# Altium schematic sheet IBVG-DRIVER.SchDoc
size Tabloid; SheetNumber: 5; SheetTotal: 10
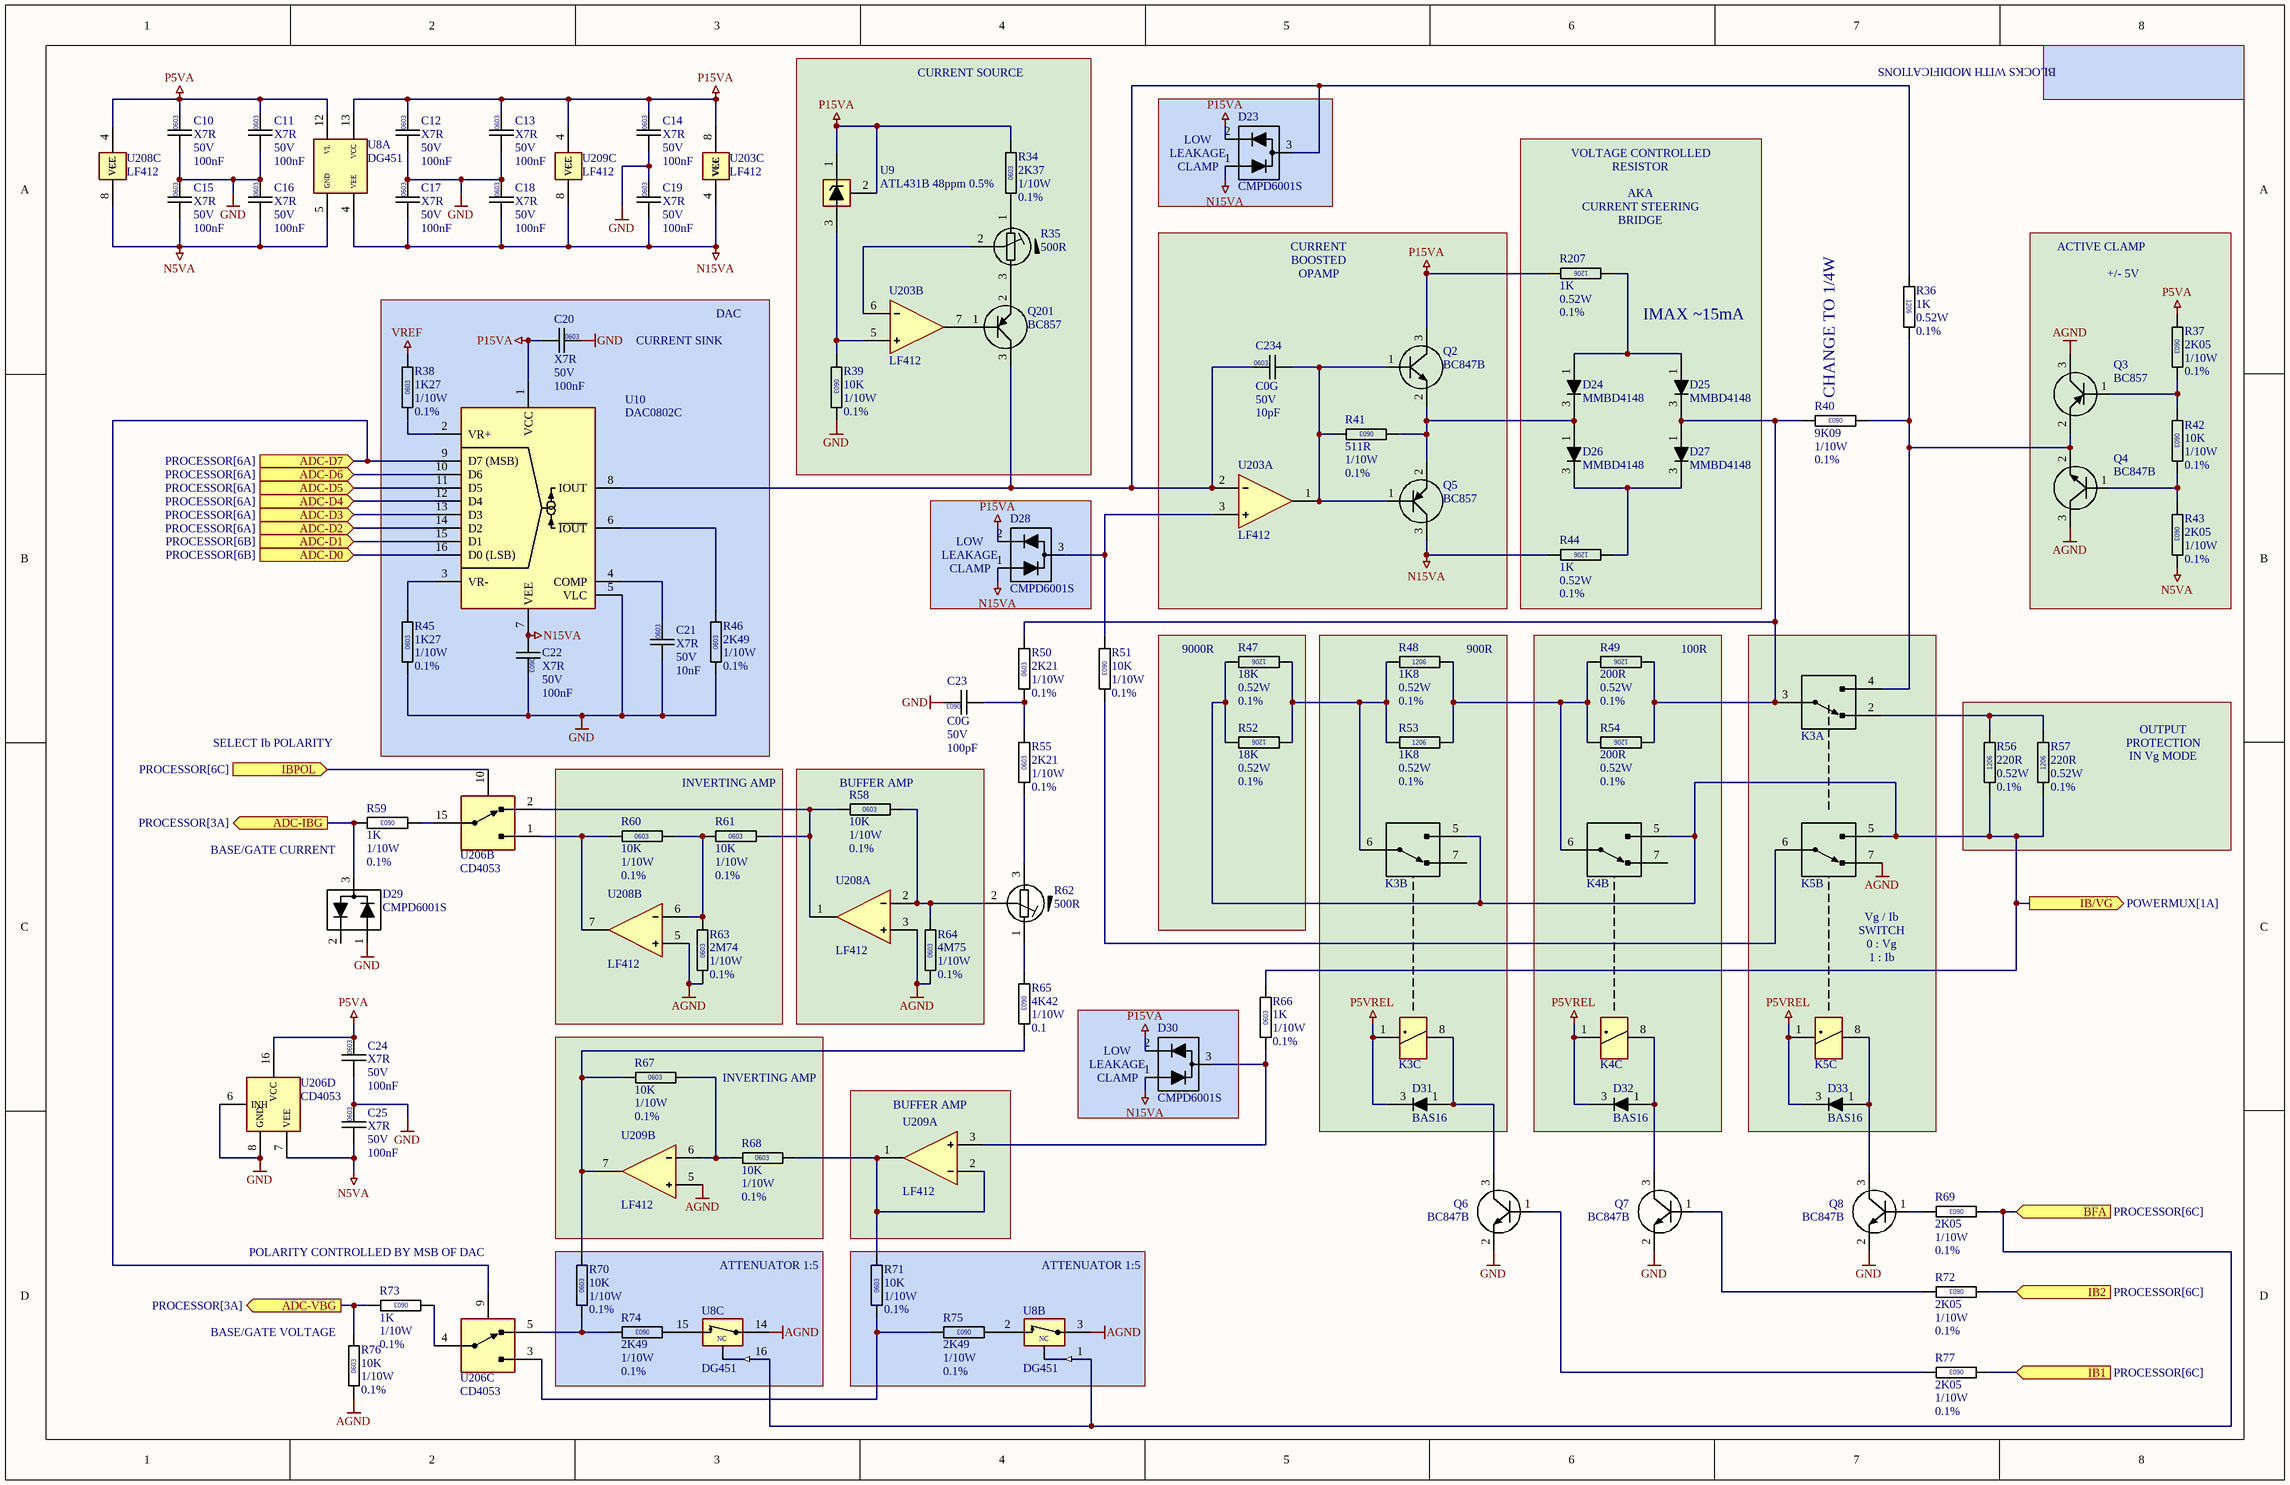
[diagram p0: IBVG-DRIVER.SchDoc]

## Parts
C10  Dielectric: X7R  Voltage: 50V  Capacitance: 100nF  [CAPC0603]  (hidden comment: CAP0603)
C11  Dielectric: X7R  Voltage: 50V  Capacitance: 100nF  [CAPC0603]  (hidden comment: CAP0603)
C12  Dielectric: X7R  Voltage: 50V  Capacitance: 100nF  [CAPC0603]  (hidden comment: CAP0603)
C13  Dielectric: X7R  Voltage: 50V  Capacitance: 100nF  [CAPC0603]  (hidden comment: CAP0603)
C14  Dielectric: X7R  Voltage: 50V  Capacitance: 100nF  [CAPC0603]  (hidden comment: CAP0603)
C15  Dielectric: X7R  Voltage: 50V  Capacitance: 100nF  [CAPC0603]  (hidden comment: CAP0603)
C16  Dielectric: X7R  Voltage: 50V  Capacitance: 100nF  [CAPC0603]  (hidden comment: CAP0603)
C17  Dielectric: X7R  Voltage: 50V  Capacitance: 100nF  [CAPC0603]  (hidden comment: CAP0603)
C18  Dielectric: X7R  Voltage: 50V  Capacitance: 100nF  [CAPC0603]  (hidden comment: CAP0603)
C19  Dielectric: X7R  Voltage: 50V  Capacitance: 100nF  [CAPC0603]  (hidden comment: CAP0603)
C20  Dielectric: X7R  Voltage: 50V  Capacitance: 100nF  [CAPC0603]  (hidden comment: CAP0603)
C21  Dielectric: X7R  Voltage: 50V  Capacitance: 10nF  [CAPC0603]  (hidden comment: CAP0603)
C22  Dielectric: X7R  Voltage: 50V  Capacitance: 100nF  [CAPC0603]  (hidden comment: CAP0603)
C23  Dielectric: C0G  Voltage: 50V  Capacitance: 100pF  [CAPC0603]  (hidden comment: CAP0603)
C24  Dielectric: X7R  Voltage: 50V  Capacitance: 100nF  [CAPC0603]  (hidden comment: CAP0603)
C25  Dielectric: X7R  Voltage: 50V  Capacitance: 100nF  [CAPC0603]  (hidden comment: CAP0603)
C234  Dielectric: C0G  Voltage: 50V  Capacitance: 10pF  [CAPC0603]  (hidden comment: CAP0603)
D23  CMPD6001S  [SOT23]
D24  MMBD4148
D25  MMBD4148
D26  MMBD4148
D27  MMBD4148
D28  CMPD6001S  [SOT23]
D29  CMPD6001S  [SOT23]
D30  CMPD6001S  [SOT23]
D31  BAS16  [SOT23]
D32  BAS16  [SOT23]
D33  BAS16  [SOT23]
K3  RELAY-KEMET-UA2-5NJ  [RELAY-KEMET-UA2-5NJ]  (value not drawn)  (parts A,B,C of 3)
K4  RELAY-KEMET-UA2-5NJ  [RELAY-KEMET-UA2-5NJ]  (value not drawn)  (parts B,C of 3)
K5  RELAY-KEMET-UA2-5NJ  [RELAY-KEMET-UA2-5NJ]  (value not drawn)  (parts B,C of 3)
Q2  BC847B  [SOT23]
Q3  BC857  [SOT23]
Q4  BC847B  [SOT23]
Q5  BC857  [SOT23]
Q6  BC847B  [SOT23]
Q7  BC847B  [SOT23]
Q8  BC847B  [SOT23]
Q201  BC857  [SOT23]
R34  value 2K37  Power: 1/10W  Tolerance: 0.1%  [RESC0603]  (hidden comment: RESC0603)
R35  value 500R  [TRIMMER-BOURNS-3214X]  (hidden comment: TRIMMER-BOURNS-3214X-1-501)
R36  value 1K  Power: 0.52W  Tolerance: 0.1%  [RESC1206]  (hidden comment: RESC1206)
R37  value 2K05  Power: 1/10W  Tolerance: 0.1%  [RESC0603]  (hidden comment: RESC0603)
R38  value 1K27  Power: 1/10W  Tolerance: 0.1%  [RESC0603]  (hidden comment: RESC0603)
R39  value 10K  Power: 1/10W  Tolerance: 0.1%  [RESC0603]  (hidden comment: RESC0603)
R40  value 9K09  Power: 1/10W  Tolerance: 0.1%  [RESC0603]  (hidden comment: RESC0603)
R41  value 511R  Power: 1/10W  Tolerance: 0.1%  [RESC0603]  (hidden comment: RESC0603)
R42  value 10K  Power: 1/10W  Tolerance: 0.1%  [RESC0603]  (hidden comment: RESC0603)
R43  value 2K05  Power: 1/10W  Tolerance: 0.1%  [RESC0603]  (hidden comment: RESC0603)
R44  value 1K  Power: 0.52W  Tolerance: 0.1%  [RESC1206]  (hidden comment: RESC1206)
R45  value 1K27  Power: 1/10W  Tolerance: 0.1%  [RESC0603]  (hidden comment: RESC0603)
R46  value 2K49  Power: 1/10W  Tolerance: 0.1%  [RESC0603]  (hidden comment: RESC0603)
R47  value 18K  Power: 0.52W  Tolerance: 0.1%  [RESC1206]  (hidden comment: RESC1206)
R48  value 1K8  Power: 0.52W  Tolerance: 0.1%  [RESC1206]  (hidden comment: RESC1206)
R49  value 200R  Power: 0.52W  Tolerance: 0.1%  [RESC1206]  (hidden comment: RESC1206)
R50  value 2K21  Power: 1/10W  Tolerance: 0.1%  [RESC0603]  (hidden comment: RESC0603)
R51  value 10K  Power: 1/10W  Tolerance: 0.1%  [RESC0603]  (hidden comment: RESC0603)
R52  value 18K  Power: 0.52W  Tolerance: 0.1%  [RESC1206]  (hidden comment: RESC1206)
R53  value 1K8  Power: 0.52W  Tolerance: 0.1%  [RESC1206]  (hidden comment: RESC1206)
R54  value 200R  Power: 0.52W  Tolerance: 0.1%  [RESC1206]  (hidden comment: RESC1206)
R55  value 2K21  Power: 1/10W  Tolerance: 0.1%  [RESC0603]  (hidden comment: RESC0603)
R56  value 220R  Power: 0.52W  Tolerance: 0.1%  [RESC1206]  (hidden comment: RESC1206)
R57  value 220R  Power: 0.52W  Tolerance: 0.1%  [RESC1206]  (hidden comment: RESC1206)
R58  value 10K  Power: 1/10W  Tolerance: 0.1%  [RESC0603]  (hidden comment: RESC0603)
R59  value 1K  Power: 1/10W  Tolerance: 0.1%  [RESC0603]  (hidden comment: RESC0603)
R60  value 10K  Power: 1/10W  Tolerance: 0.1%  [RESC0603]  (hidden comment: RESC0603)
R61  value 10K  Power: 1/10W  Tolerance: 0.1%  [RESC0603]  (hidden comment: RESC0603)
R62  value 500R  [TRIMMER-BOURNS-3214X]  (hidden comment: TRIMMER-BOURNS-3214X-1-501)
R63  value 2M74  Power: 1/10W  Tolerance: 0.1%  [RESC0603]  (hidden comment: RESC0603)
R64  value 4M75  Power: 1/10W  Tolerance: 0.1%  [RESC0603]  (hidden comment: RESC0603)
R65  value 4K42  Power: 1/10W  Tolerance: 0.1  [RESC0603]  (hidden comment: RESC0603)
R66  value 1K  Power: 1/10W  Tolerance: 0.1%  [RESC0603]  (hidden comment: RESC0603)
R67  value 10K  Power: 1/10W  Tolerance: 0.1%  [RESC0603]  (hidden comment: RESC0603)
R68  value 10K  Power: 1/10W  Tolerance: 0.1%  [RESC0603]  (hidden comment: RESC0603)
R69  value 2K05  Power: 1/10W  Tolerance: 0.1%  [RESC0603]  (hidden comment: RESC0603)
R70  value 10K  Power: 1/10W  Tolerance: 0.1%  [RESC0603]  (hidden comment: RESC0603)
R71  value 10K  Power: 1/10W  Tolerance: 0.1%  [RESC0603]  (hidden comment: RESC0603)
R72  value 2K05  Power: 1/10W  Tolerance: 0.1%  [RESC0603]  (hidden comment: RESC0603)
R73  value 1K  Power: 1/10W  Tolerance: 0.1%  [RESC0603]  (hidden comment: RESC0603)
R74  value 2K49  Power: 1/10W  Tolerance: 0.1%  [RESC0603]  (hidden comment: RESC0603)
R75  value 2K49  Power: 1/10W  Tolerance: 0.1%  [RESC0603]  (hidden comment: RESC0603)
R76  value 10K  Power: 1/10W  Tolerance: 0.1%  [RESC0603]  (hidden comment: RESC0603)
R77  value 2K05  Power: 1/10W  Tolerance: 0.1%  [RESC0603]  (hidden comment: RESC0603)
R207  value 1K  Power: 0.52W  Tolerance: 0.1%  [RESC1206]  (hidden comment: RESC1206)
U8  DG451  [SO127P600-16N]  (parts A,B,C of 5)
U9  ATL431B 48ppm 0.5%  [SOT23]
U10  DAC0802C
U203  LF412  [SO127P600-8N]  (parts A,B,C of 3)
U206  CD4053  [SO127P600-16N]  (parts B,C,D of 4)
U208  LF412  [SO127P600-8N]  (parts A,B,C of 3)
U209  LF412  [SO127P600-8N]  (parts A,B,C of 3)

## Blocks framed on the sheet
CURRENT SOURCE: Q201 R34 R35 R39 U9 U203
IMAX ~15mA: D24-D27 R44 R207
9000R: R47 R52
900R: D31 K3 R48 R53
100R: D32 K4 R49 R54
INVERTING AMP: R60 R61 R63 U208
BUFFER AMP: R58 R64 U208
INVERTING AMP: R67 R68 U209
BUFFER AMP: U209
ATTENUATOR 1:5: R70 R74 U8
ATTENUATOR 1:5: R71 R75 U8

## Ports
ADC-D0 (in, see PROCESSOR[6B]), ADC-D1 (in, see PROCESSOR[6B]), ADC-D2 (in, see PROCESSOR[6A]), ADC-D3 (in, see PROCESSOR[6A]), ADC-D4 (in, see PROCESSOR[6A]), ADC-D5 (in, see PROCESSOR[6A]), ADC-D6 (in, see PROCESSOR[6A]), ADC-D7 (in, see PROCESSOR[6A]), ADC-IBG (out, see PROCESSOR[3A]), ADC-VBG (out, see PROCESSOR[3A]), BFA (in, see PROCESSOR[6C]), IB1 (in, see PROCESSOR[6C]), IB2 (in, see PROCESSOR[6C]), IB/VG (out, see POWERMUX[1A]), IBPOL (in, see PROCESSOR[6C])

## Nets
AGND: K5.7(NC) Q3.3(C) Q4.3(C) R63.2 R64.2 R76.2 U8.3 U8.14 U208.3(+) U208.5(+) U209.5(+)
GND: C10.2 C11.2 C12.2 C13.2 C14.2 C15.1 C16.1 C17.1 C18.1 C19.1 C20.1 C21.2 C22.1 C23.1 C24.2 C25.1 D29.1(K) Q6.2(E) Q7.2(E) Q8.2(E) R39.1 R45.2 R46.2 U10.5(VLC) U206.6(INH) U206.8(GND)
N5VA: C15.2 C16.2 C25.2 R43.2 U8.5(GND) U206.7(VEE) U208.8(VCC)
N15VA: C17.2 C18.2 C19.2 C22.2 D23.1(K) D28.1(K) D30.1(K) Q5.3(C) R44.1 U8.4(VEE) U10.7(VEE) U203.4(VEE) U209.8(VCC)
P5VA: C10.1 C11.1 C24.1 R37.1 U8.12(VL) U206.16(VCC) U208.4(VEE)
P5VREL: D31.3(K) D32.3(K) D33.3(K) K3.1 K4.1 K5.1
P15VA: C12.1 C13.1 C14.1 C20.2 D23.2(A) D28.2(A) D30.2(A) Q2.3(C) R34.1 R207.1 U8.13(VCC) U9.1 U9.2 U10.1(VCC) U203.8(VCC) U209.4(VEE)
VREF: R38.1
ADC-D0: U10.16(D0_(LSB)) ; port ADC-D0
ADC-D1: U10.15(D1) ; port ADC-D1
ADC-D2: U10.14(D2) ; port ADC-D2
ADC-D3: U10.13(D3) ; port ADC-D3
ADC-D4: U10.12(D4) ; port ADC-D4
ADC-D5: U10.11(D5) ; port ADC-D5
ADC-D6: U10.10(D6) ; port ADC-D6
ADC-D7: U10.9(D7_(MSB)) U206.9(B) ; port ADC-D7
ADC-IBG: D29.3(A) R59.1 ; port ADC-IBG
ADC-VBG: R73.1 R76.1 ; port ADC-VBG
BFA: R69.1 U8.1 U8.16 ; port BFA
IB1: R77.1 ; port IB1
IB2: R72.1 ; port IB2
IB/VG: K3.5(NO) K4.5(NO) K5.5(NO) R47.2 R52.2 R56.2 R57.2 R66.1 ; port IB/VG
IBPOL: U206.10(A) ; port IBPOL
NetC21_1: C21.1 U10.4(COMP)
NetC23_2: C23.2 R50.2 R55.1
NetC234_1: C234.1 D23.3(A) Q201.3(C) R36.2 U10.8(IOUT) U203.2(-)
NetC234_2: C234.2 Q2.1(B) Q5.1(B) R41.1 U203.1(O)
NetD24_1: D24.1(A) D25.1(A) R207.2
NetD24_3: D24.3(K) D26.1(A) Q2.2(E) Q5.2(E) R41.2
NetD25_3: D25.3(K) D27.1(A) K3.3(COM) R40.1 R49.1 R50.1 R54.1
NetD26_3: D26.3(K) D27.3(K) R44.2
NetD28_3: D28.3(A) R51.2 U203.3(+)
NetD30_3: D30.3(A) R66.2 U209.3(+)
NetD31_1: D31.1(A) K3.8 Q6.3(C)
NetD32_1: D32.1(A) K4.8 Q7.3(C)
NetD33_1: D33.1(A) K5.8 Q8.3(C)
NetK3_2: K3.2(NC) R56.1 R57.1
NetK3_4: K3.4(NO) Q3.2(E) Q4.2(E) R36.1 R40.2
NetK3_6: K3.6(COM) R47.1 R48.1 R52.1 R53.1
NetK4_6: K4.6(COM) R48.2 R49.2 R53.2 R54.2
NetK5_6: K5.6(COM) R51.1
NetQ3_1: Q3.1(B) R37.2 R42.2
NetQ4_1: Q4.1(B) R42.1 R43.1
NetQ6_1: Q6.1(B) R77.2
NetQ7_1: Q7.1(B) R72.2
NetQ8_1: Q8.1(B) R69.2
NetQ201_1: Q201.1(B) U203.7(O)
NetQ201_2: Q201.2(E) R35.3
NetR34_2: R34.2 R35.1
NetR35_2: R35.2 U203.6(-)
NetR38_2: R38.2 U10.2(VR+)
NetR39_2: R39.2 U9.3 U203.5(+)
NetR45_1: R45.1 U10.3(VR-)
NetR46_1: R46.1 U10.6(~{IOUT})
NetR55_2: R55.2 R62.3
NetR58_1: R58.1 R62.2 R64.1 U208.2(-)
NetR58_2: R58.2 R61.1 U206.2(Y2) U208.1(O)
NetR59_2: R59.2 U206.15(X2)
NetR60_1: R60.1 R61.2 R63.1 U208.6(-)
NetR60_2: R60.2 U206.1(Y0) U208.7(O)
NetR62_1: R62.1 R65.2
NetR65_1: R65.1 R67.2 R70.1 U209.7(O)
NetR67_1: R67.1 R68.2 U209.6(-)
NetR68_1: R68.1 R71.1 U209.1(O) U209.2(-)
NetR70_2: R70.2 R74.1 U206.5(Y1)
NetR71_2: R71.2 R75.1 U206.3(Y)
NetR73_2: R73.2 U206.4(Y3)
NetR74_2: R74.2 U8.15
NetR75_2: R75.2 U8.2

Not connected (* = marked no-connect by the designer): D29 2(A); K3 7(NC); K4 7(NC)

## Notes on the sheet
- BLOCKS WITH MODIFICATIONS
- (near D23) LOW
- (near D23) LEAKAGE
- (near D23) CLAMP
- VOLTAGE CONTROLLED
- RESISTOR
- AKA
- CURRENT STEERING
- (near R207) BRIDGE
- CURRENT
- BOOSTED
- OPAMP
- ACTIVE CLAMP
- +/- 5V
- CURRENT SINK
- DAC
- (near R40) CHANGE TO 1/4W
- (near D28) LOW
- (near D28) LEAKAGE
- (near D28) CLAMP
- SELECT Ib POLARITY
- PROTECTION
- IN Vg MODE
- OUTPUT
- BASE/GATE CURRENT
- SWITCH
- 0 : Vg
- (near K5) Vg / Ib
- 1 : Ib
- (near D30) LOW
- (near D30) LEAKAGE
- (near D30) CLAMP
- POLARITY CONTROLLED BY MSB OF DAC
- (near R76) BASE/GATE VOLTAGE
- (in symbol IC-SILICONIX-DG451, part B) NC
- (in symbol IC-SILICONIX-DG451, part C) NC
- (in symbol RESC-0603-1K27-0.1%-1/10W) 0603
- (in symbol RESC-0603-1K-0.1%-1/10W) 0603
- (in symbol RESC-0603-2K05-0.1%-1/10W) 0603
- (in symbol RESC-0603-2K21-0.1%-1/10W) 0603
- (in symbol RESC-0603-2K37-0.1%-1/10W) 0603
- (in symbol RESC-0603-2K49-0.1%-1/10W) 0603
- (in symbol RESC-0603-2M74-0.1%-1/10W) 0603
- (in symbol RESC-0603-4K42-0.1%-1/10W) 0603
- (in symbol RESC-0603-4M75-1%-1/10W) 0603
- (in symbol RESC-0603-9K09-0.1%-1/10W) 0603
- (in symbol RESC-0603-10K-0.1%-1/10W) 0603
- (in symbol RESC-0603-511R-0.1%-1/10W) 0603
- (in symbol RESC-1206-1K8-0.1%-1/2W) 1206
- (in symbol RESC-1206-1K-0.1%-1/2W) 1206
- (in symbol RESC-1206-18K-0.1%-1/2W) 1206
- (in symbol RESC-1206-200R-0.1%-1/2W) 1206
- (in symbol RESC-1206-220R-0.1%-1/2W) 1206

## Library data of the parts
C10-C20 C22 C24 C25 = CAPC-0603-100nF-50V-X7R: CAPACITOR,CERAMIC,100nF,50V,X7R,0603; Manufacturer 1: KEMET; Manufacturer Part Number 1: C0603C104K5RACTU; Package / Case: 0603; Location: *; Supplier 1: Mouser; Supplier Part Number 1: 80-C0603C104K5R7867; Supplier 2: Mouser; Supplier Part Number 2: 80-C0603C104K5R7411; Supplier 3: Avnet; Supplier Part Number 3: KGM15BR71H104KT; Supplier 4: Digikey; Supplier Part Number 4: 1276-1000-1-ND; LCSC: C127833; MOUSER: 80-C0603C104K5R
C21 = CAPC-0603-10nF-50V-X7R: CAPACITOR,CERAMIC,10nF,50V,X7R,0603; Package / Case: 0603; Location: *
C23 = CAPC-0603-100pF-50V-C0G: CAPACITOR,CERAMIC,100pF,50V,C0G,0603; Package / Case: 0603; Location: *
C234 = CAPC-0603-10PF-50V-C0G: CAPACITOR,CERAMIC,10pF,50V,C0G,0603; Manufacturer 1: KYOCERA; Manufacturer Part Number 1: C0603C100J5GAC; Package / Case: 0603; Location: *; MOUSER: 80-C0603C100J5GAC
D23 D28-D30 = DIODE-CENTRALSEMI-CMPD6001S: DIODE,75V,250mA,SOT23,500pA ULTRA LOW LEAKAGE; Manufacturer 1: CENTRAL SEMICONDUCTOR; Manufacturer Part Number 1: CMPD6001S
D24-D27 = DIODE-RECTIFIER-DIODES-MMBD4148-SOT23: DIODE,RECTIFIER,75V,0.3A,MMBD4148,SOT23; Manufacturer 1: DIODES; Manufacturer Part Number 1: MMBD4148
D31-D33 = DIODE-RECTIFIER-DIODES-BAS16-SOT23: DIODE,RECTIFIER,75V,0.3A,BAS16,SOT23; Manufacturer 1: ONSEMI; Manufacturer Part Number 1: BAS16LT1G
K3-K5 = RELAY-KEMET-UA2-5NJ: RELAY,DPDT,1A,250VAC,220VDC,5V COIL,KEMET,UA2-5NJ; DIGIKEY: 399-UA2-5NJ-ND; Manufacturer 1: KEMET; Manufacturer Part Number 1: UA2-5NJ
Q2 Q4 Q6-Q8 = XSTR-NPN-BC847: XSTR,NPN,45V,0.1A,,BC847B,SOT23
Q3 Q5 Q201 = XSTR-PNP-BC857: XSTR,PNP,SOT23,BC857,SOT23; Manufacturer 1: NEXPERIA; Manufacturer Part Number 1: BC857BW,115; DIGIKEY: 1727-4869-1-ND
R34 = RESC-0603-2K37-0.1%-1/10W: RESISTOR,2K37,0.1%,100mW,0603 (1608); Location: *
R35 R62 = TRIMMER-BOURNS-3214X-1-501: RESISTOR,MULTITURN,VERTICAL,5T,500R; Manufacturer 1: BOURNS; Manufacturer Part Number 1: 3214X-1-501E
R36 R44 R207 = RESC-1206-1K-0.1%-1/2W: RESISTOR,1K,1206,0.1%,520mW,1206; Manufacturer 1: VISHAY; Manufacturer Part Number 1: TNPW12061K00BEEA; Location: *; Parameter 4: *
R37 R43 R69 R72 R77 = RESC-0603-2K05-0.1%-1/10W: RESISTOR,2K05,0.11%,100mW,0603 (1608); Location: *
R38 R45 = RESC-0603-1K27-0.1%-1/10W: RESISTOR,1K27,0.1%,100mW,0603 (1608); Location: *
R39 R42 R51 R58 R60 R61 R67 R68 R70 R71 R76 = RESC-0603-10K-0.1%-1/10W: RESISTOR,10K,0.1%,100mW,0603 (1608); Manufacturer 1: PANASONIC; Manufacturer Part Number 1: ERA-3AEB103V; Location: *; DIGIKEY: P10KDBCT-ND
R40 = RESC-0603-9K09-0.1%-1/10W: RESISTOR,9K09,0.1%,100mW,0603 (1608); Location: *
R41 = RESC-0603-511R-0.1%-1/10W: RESISTOR,511R,0.1%,100mW,0603 (1608); Location: *
R46 R74 R75 = RESC-0603-2K49-0.1%-1/10W: RESISTOR,2K49,0.1%,100mW,0603 (1608); Location: *
R47 R52 = RESC-1206-18K-0.1%-1/2W: RESISTOR,18K,1206,0.1%,520mW,1206; Manufacturer 1: VISHAY; Manufacturer Part Number 1: TNPW1206220RBEEA; Location: *; Parameter 4: *
R48 R53 = RESC-1206-1K8-0.1%-1/2W: RESISTOR,1K8,1206,0.1%,520mW,1206; Manufacturer 1: VISHAY; Manufacturer Part Number 1: TNPW12061K80BEEA; Location: *; Parameter 4: *
R49 R54 = RESC-1206-200R-0.1%-1/2W: RESISTOR,200R,1206,0.1%,520mW,1206; Manufacturer 1: VISHAY; Manufacturer Part Number 1: TNPW1206200RBEEA; Location: *; Parameter 4: *
R50 R55 = RESC-0603-2K21-0.1%-1/10W: RESISTOR,2K21,0.1%,100mW,0603 (1608); Location: *
R56 R57 = RESC-1206-220R-0.1%-1/2W: RESISTOR,220R,1206,0.1%,520mW,1206; Manufacturer 1: VISHAY; Manufacturer Part Number 1: TNPW1206220RBEEA; Location: *; Parameter 4: *
R59 R66 R73 = RESC-0603-1K-0.1%-1/10W: RESISTOR,1K,0.1%,100mW,0603 (1608); Location: *
R63 = RESC-0603-2M74-0.1%-1/10W: RESISTOR,2M74,0.1%,100mW,0603 (1608); Location: *
R64 = RESC-0603-4M75-1%-1/10W: RESISTOR,4M75,0.1%,100mW,0603 (1608); Location: *
R65 = RESC-0603-4K42-0.1%-1/10W: RESISTOR,4K42,0.1%,100mW,0603 (1608); Location: *
U8 = IC-SILICONIX-DG451: IC,ANALOG,4XSPST ANALOG SWITCH,NC,,SILICONIX,DG451,SO16; Manufacturer 1: VISHAY SILICONIX; Manufacturer Part Number 1: DG451EY-T1-E3; DIGIKEY: DG451EY-T1-E3CT-ND
U9 = IC-TI-ATL431B-SOT23: IC,REGULATOR,REFERENCE,SHUNT,0.5%,48ppm,TL431,SOT23; Manufacturer 1: TI; Manufacturer Part Number 1: ATL431BIDBZR; DIGIKEY: 296-47739-1-ND
U10 = IC-TI-DAC0802LCMX/NOPB: IC,DAC,8 BIT,CURRENT DIFF,TI,DAC0802LCMX/NOPB,SO16; DIGIKEY: DAC0802LCMX/NOPBCT-ND; Manufacturer 1: TI; Manufacturer Part Number 1: DAC0802LCMX/NOPB
U203 U208 U209 = IC-TI-LF412-S08: IC,OPAMP JFET,DUAL,LF412,SO8
U206 = IC-TI-CD4053-SPLIT: IC,LOGIC,CMOS,4XXX,TRIPLE 2:1 MUX,SPLIT BLOCKS